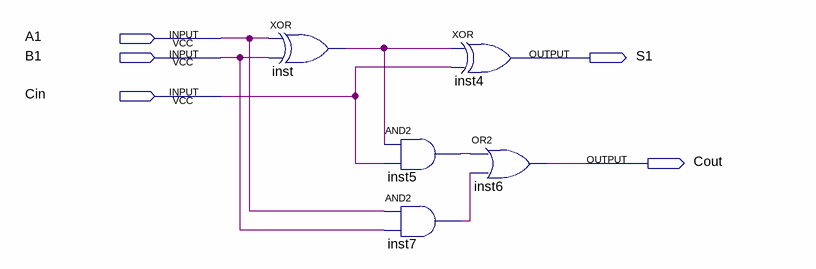
[diagram p0: schematic sheet]
// Quartus schematic FullAdder.bdf as structural Verilog: 5 symbols, 5 pins
module FullAdder (
  input  A1,
  input  B1,
  input  Cin,
  output S1,
  output Cout
);

  wire inst5_out, inst7_out, inst_out;

  xor inst (inst_out, A1, B1);
  and inst5 (inst5_out, inst_out, Cin);
  and inst7 (inst7_out, A1, B1);
  xor inst4 (S1, inst_out, Cin);
  or inst6 (Cout, inst5_out, inst7_out);
endmodule
